# EAGLE design Day0-Ahmad Hafizh Al-Fauzi-13215062 (EAGLE 7.5.0)
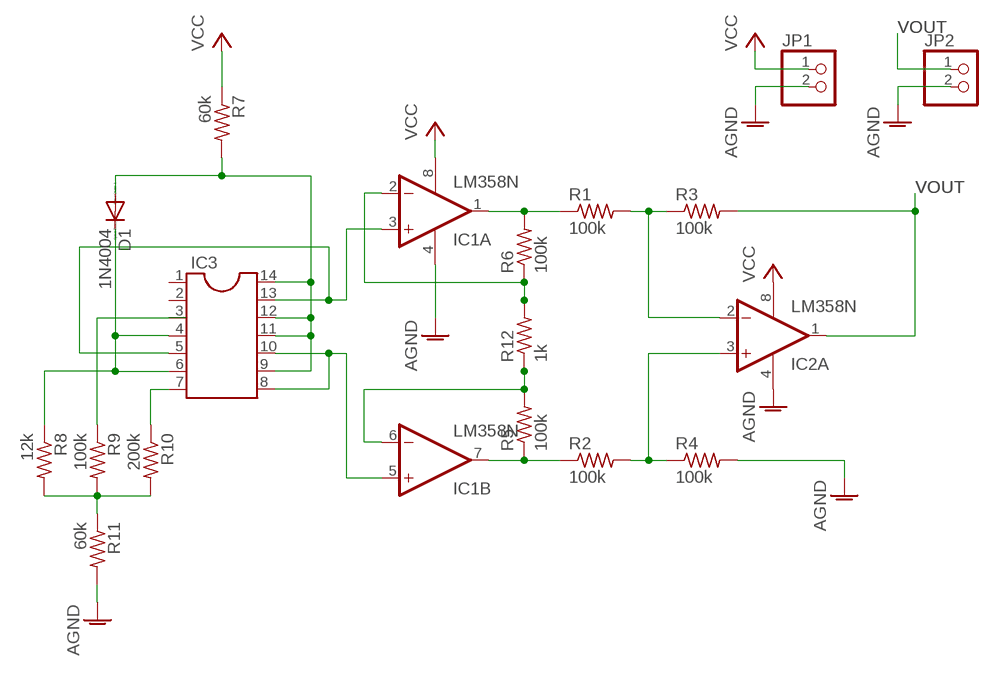
[diagram p0: schematic, sheet 1]

## Parts
D1  1N4004  [DO41-10]
IC1  LM358N  [DIL08]
IC2  LM358N  [DIL08]
IC3  DIL14  [DIL14]
JP1  PINHD-1X2  [1X02]
JP2  PINHD-1X2  [1X02]
R1  100k  R-US_0204/7  [0204/7]
R2  100k  R-US_0204/7  [0204/7]
R3  100k  R-US_0204/7  [0204/7]
R4  100k  R-US_0204/7  [0204/7]
R5  100k  R-US_0204/7  [0204/7]
R6  100k  R-US_0204/7  [0204/7]
R7  60k  R-US_0204/7  [0204/7]
R8  12k  R-US_0204/7  [0204/7]
R9  100k  R-US_0204/7  [0204/7]
R10  200k  R-US_0204/7  [0204/7]
R11  60k  R-US_0204/7  [0204/7]
R12  1k  R-US_0204/7  [0204/7]

## Nets
AGND: IC1.4(P:V-) IC2.4(P:V-) JP1.2 JP2.2 R4.2 R11.2
MALE_HEADER1: JP1.1 ; supply symbol labelled VCC
N$1: R8.2 R9.2 R10.2 R11.1
N$2: IC1.6(B:-IN) R5.2 R12.1
N$3: IC1.2(A:-IN) R6.1 R12.2
N$4: D1.A IC3.9 IC3.11 IC3.12 IC3.14 R7.2
N$5: IC1.3(A:+IN) IC3.5 IC3.13
N$6: D1.C IC3.4 IC3.6 R8.1
N$7: IC3.3 R9.1
N$8: IC1.5(B:+IN) IC3.8 IC3.10
N$9: IC2.3(A:+IN) R2.2 R4.1
N$10: IC1.7(B:OUT) R2.1 R5.1
N$11: IC1.1(A:OUT) R1.1 R6.2
N$12: IC2.2(A:-IN) R1.2 R3.1
N$13: IC3.7 R10.1
VCC: IC1.8(P:V+) IC2.8(P:V+) R7.1
VOUT: IC2.1(A:OUT) JP2.1 R3.2
Unconnected: IC2.5(B:+IN) IC2.6(B:-IN) IC2.7(B:OUT) IC3.1 IC3.2

## Library data of the parts
D1 = diode:1N4004: DIODE general purpose rectifier, 1 A
IC1 IC2 = linear:LM358: OP AMP also LM158; LM258; LM2904 Source: http://cache.national.com/ds/LM/LM158.pdf
IC3 = ic-package:DIL14: Dual In Line / Socket
JP1 JP2 = pinhead:PINHD-1X2: PIN HEADER
R1-R12 = resistor:R-US_: RESISTOR, American symbol

## Board
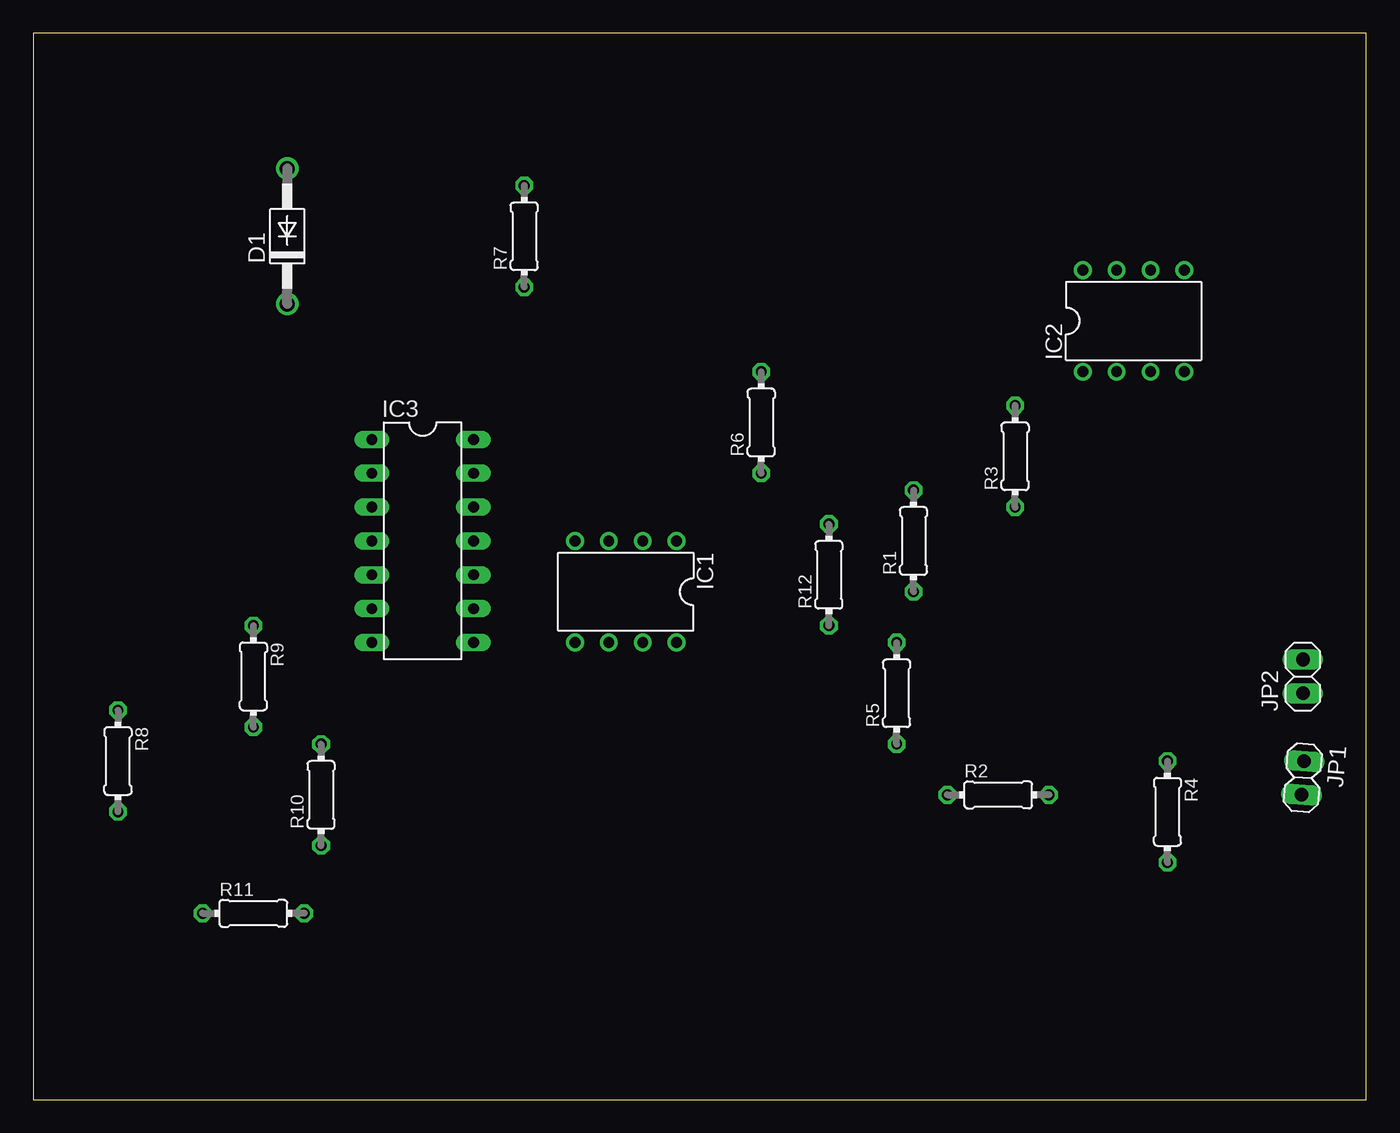
[diagram p1: board, top side]
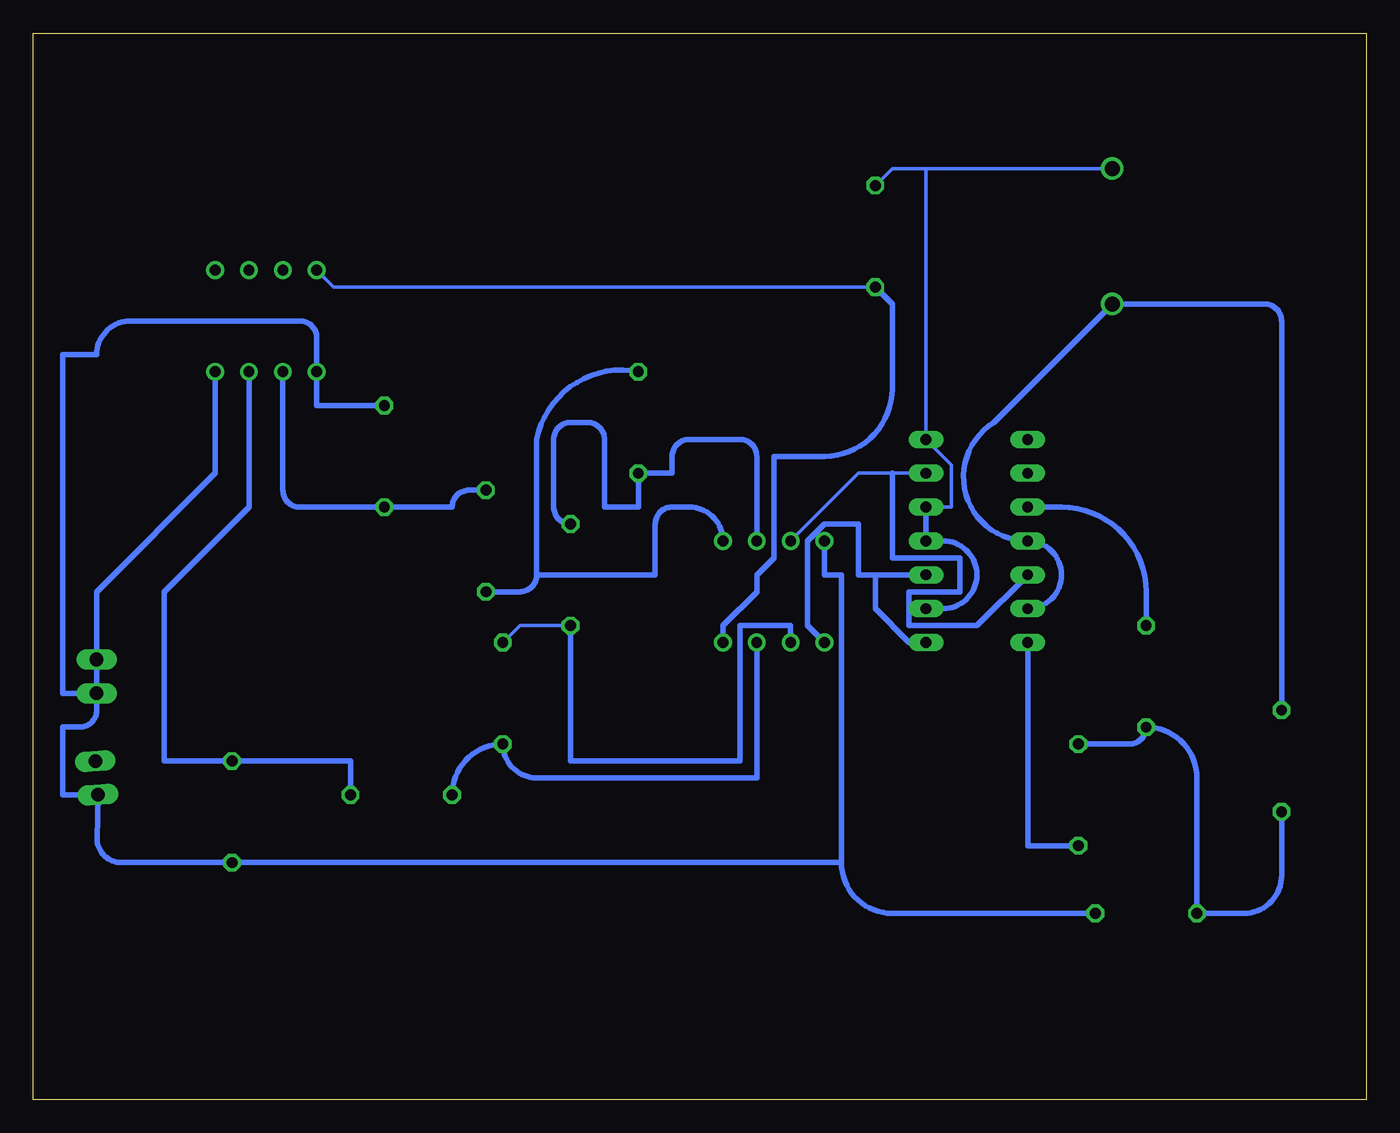
[diagram p2: board, bottom side, seen from below]

Size 100 x 80 mm. Coordinates in mm from the lower left corner, seen from the top.
Outline: 0,0 100,0 100,80 0,80 0,0
Copper layers (1*16): Top 0.035mm / dielectric 1.5mm / Bottom 0.035mm
Design rules "default": minimum track width 10mil, minimum drill 24mil, track to track 8mil, track to pad 8mil, pad to pad 8mil, via to via 8mil, smd to smd 8mil, copper to edge 40mil, drill to drill 8mil, minimum pad ring 10mil, minimum via ring 8mil, stop-mask expansion 4mil, vias tented up to drill 0mil, thermal gap 10mil

### Footprints (pad centres in the part's own frame; a part is rotated, then mirrored left to right if it is on the bottom)
DO41-10 = drill 1.118: A 5.08,0; C -5.08,0
DIL08 = drill 0.813 pad 1.27: 1 -3.81,-3.81; 2 -1.27,-3.81; 3 1.27,-3.81; 4 3.81,-3.81; 5 3.81,3.81; 6 1.27,3.81; 7 -1.27,3.81; 8 -3.81,3.81
DIL14 = drill 0.813 long: 1 -7.62,-3.81; 2 -5.08,-3.81; 3 -2.54,-3.81; 4 0,-3.81; 5 2.54,-3.81; 6 5.08,-3.81; 7 7.62,-3.81; 8 7.62,3.81; 9 5.08,3.81; 10 2.54,3.81; 11 0,3.81; 12 -2.54,3.81; 13 -5.08,3.81; 14 -7.62,3.81
1X02 = drill 1.016 long: 1 -1.27,0; 2 1.27,0
0204/7 = drill 0.813 octagon: 1 -3.81,0; 2 3.81,0

### Placement (x,y rotation side)
D1  19.05,64.77 90 top
IC1  44.45,38.1 180 top
IC2  82.55,58.42 0 top
IC3  29.21,41.91 270 top
JP1  95.25,24.13 265.4 top
JP2  95.25,31.75 90 top
R1  66.04,41.91 90 top
R2  72.39,22.86 0 top
R3  73.66,48.26 90 top
R4  85.09,21.59 270 top
R5  64.77,30.48 90 top
R6  54.61,50.8 90 top
R7  36.83,64.77 90 top
R8  6.35,25.4 270 top
R9  16.51,31.75 270 top
R10  21.59,22.86 90 top
R11  16.51,13.97 0 top
R12  59.69,39.37 90 top

### Tracks (layer width: path | path; a pad name or v marks a point on that pad's centre or on a via)
AGND
  Bottom 0.406: 39.37,17.78 arc-90 35.56,13.97 R11.2 | 39.37,17.78 39.37,39.37 40.64,39.37 IC1.4 | 39.37,17.78 R4.2 93.42,17.78 arc91 95.21,19.61 JP1.2 97.79,22.86 97.79,27.94 96.52,27.94 arc-90 95.25,29.21 JP2.2 95.25,38.1 86.36,46.99 IC2.4
N$1
  Bottom 0.406: R8.2 6.35,16.81 arc90 9.19,13.97 R11.1 12.7,24.13 arc-90 R9.2 arc90 17.78,26.67 R10.2
N$2
  Bottom 0.254: R5.2 63.5,35.56 R12.1
  Bottom 0.406: R12.1 59.69,25.4 46.99,25.4 46.99,35.56 43.18,35.56 IC1.6
N$3
  Bottom 0.406: IC1.2 45.72,48.26 arc-90 46.99,49.53 50.8,49.53 arc-90 52.07,48.26 52.07,46.99 R6.1 54.61,44.45 57.15,44.45 57.15,49.53 arc-90 58.42,50.8 59.69,50.8 arc-90 60.96,49.53 60.96,44.45 arc-90 R12.2
N$4
  Bottom 0.254: IC3.12 31.11,44.45 31.11,47.62 IC3.14 33.02,69.85 | R7.2 35.56,69.85 33.02,69.85 | D1.A 33.02,69.85
  Bottom 0.406: IC3.12 IC3.11 31.75,41.91 arc90 29.21,39.37 arc90 31.75,36.83 IC3.9
N$5
  Bottom 0.254: IC1.3 38.1,46.99 35.56,46.99 IC3.13
  Bottom 0.406: IC3.5 29.21,35.56 34.29,35.56 34.29,38.1 30.48,38.1 30.48,40.64 35.56,40.64 35.56,46.99
N$6
  Bottom 0.406: IC3.6 arc-180 IC3.4 arc148 27.94,50.8 D1.C 7.62,59.69 arc90 6.35,58.42 R8.1
N$7
  Bottom 0.406: R9.1 16.51,38.1 arc-90 22.86,44.45 IC3.3
N$8
  Bottom 0.406: IC3.10 36.83,39.37 | 36.83,39.37 38.1,39.37 38.1,43.18 40.64,43.18 41.91,41.91 41.91,35.56 IC1.5 | IC3.8 34.29,34.29 36.83,36.83 36.83,39.37
N$9
  Bottom 0.406: R2.2 76.2,25.4 R4.1 90.17,25.4 90.17,38.1 83.82,44.45 IC2.3
N$10
  Bottom 0.406: R2.1 arc90 R5.1 arc-90 62.23,24.13 45.72,24.13 IC1.7
N$11
  Bottom 0.406: R6.2 arc-90 62.23,49.53 62.23,39.37 | 62.23,39.37 arc90 63.5,38.1 R1.1 | IC1.1 arc-90 50.8,44.45 52.07,44.45 arc-90 53.34,43.18 53.34,39.37 62.23,39.37
N$12
  Bottom 0.406: IC2.2 81.28,45.72 arc-90 80.01,44.45 R3.1 68.58,44.45 arc90 67.31,45.72 R1.2
N$13
  Bottom 0.406: R10.1 25.4,19.05 IC3.7
VCC
  Bottom 0.254: IC2.8 77.47,60.96 R7.1
  Bottom 0.406: R7.1 35.56,59.69 35.56,53.34 arc90 40.64,48.26 44.45,48.26 44.45,40.64 45.72,39.37 45.72,38.1 48.26,35.56 IC1.8
VOUT
  Bottom 0.406: R3.2 78.74,52.07 IC2.1 78.74,57.15 arc-90 80.01,58.42 92.71,58.42 arc-90 95.25,55.88 97.79,55.88 97.79,30.48 JP2.1